# EAGLE design MRCS-Buckeroo (EAGLE 7.7.0)
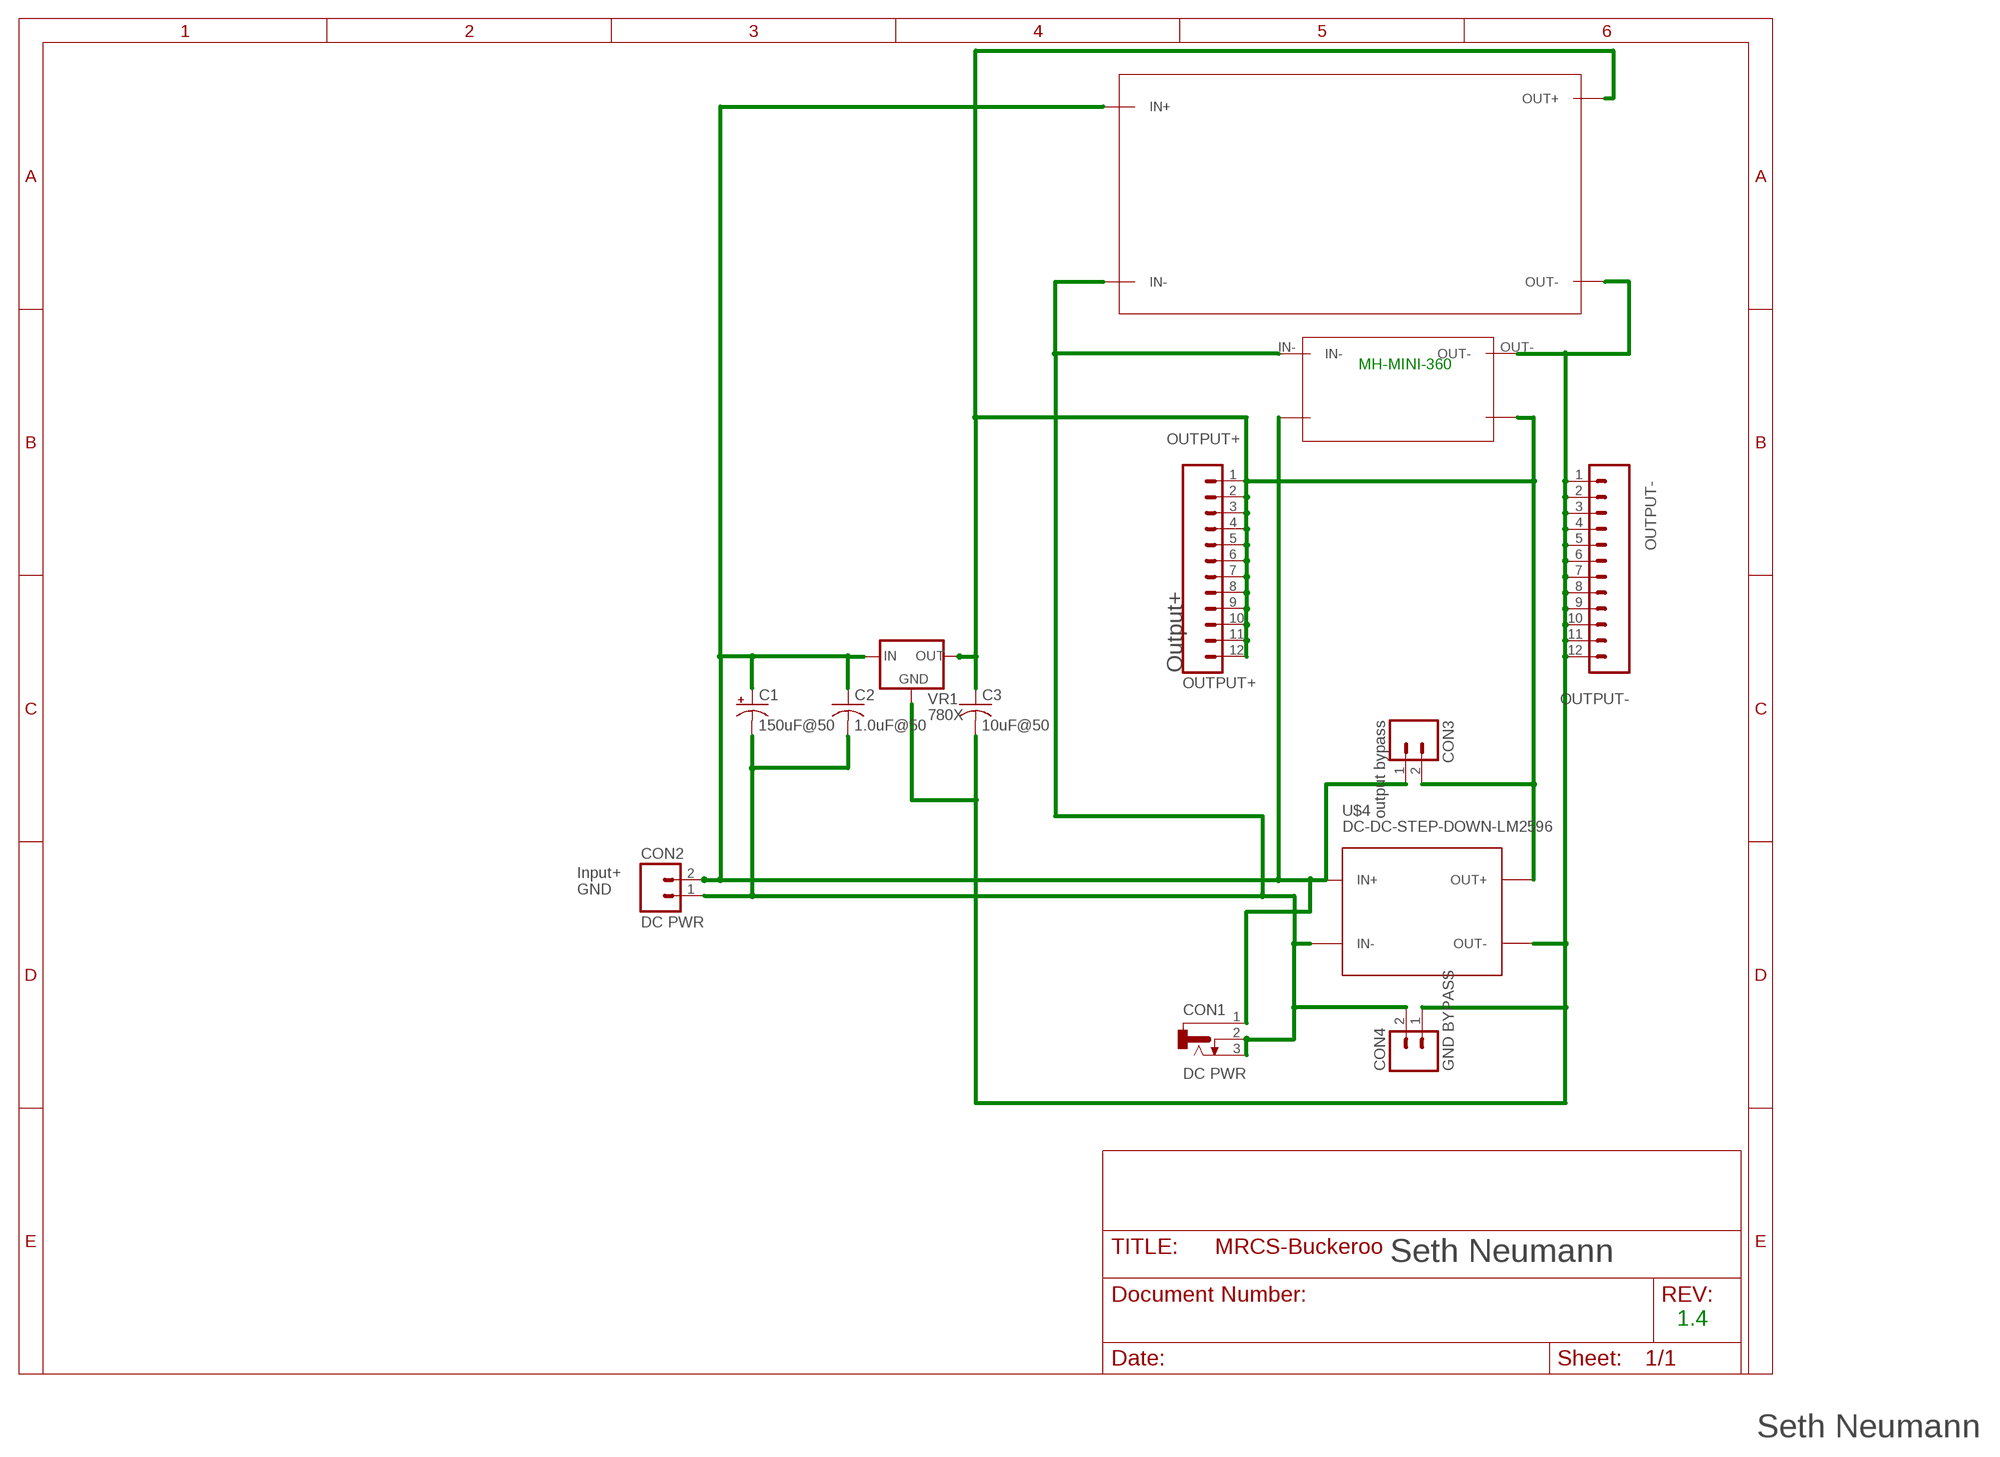
[diagram p0: schematic, sheet 1]

## Parts
C1  150uF@50  CAP-POLPTH-5MM  [E5-10.5]
C2  1.0uF@50  CAPPTH2  [C-PTH-0.100]
C3  10uF@50  CAPPTH2  [C-PTH-0.100]
CON1  DC PWR  CONNECTOR-DC-POWER-RA  [DCJ0202]
CON2  DC PWR  CONNECTOR-M023.5MM-LOCK  [SCREWTERMINAL-3.5MM-2_LOCK]
CON3  output bypass  CONNECTOR-M02MOLEX-1X02-LOCK  [MOLEX-1X2_LOCK]
CON4  GND BYPASS  CONNECTOR-M02MOLEX-1X02-LOCK  [MOLEX-1X2_LOCK]
MH-MINI-360  MH-MINI-360  [MH-MINI-360]
OUTPUT+  OUTPUT+  CONNECTOR-M12LOCK  [1X12_LOCK]
OUTPUT-  OUTPUT-  CONNECTOR-M12LOCK  [1X12_LOCK]
U$4  DC-DC-STEP-DOWN-LM2596  [DC-DC-STEP-DOWN-LM2596]
U$5  XL6009BOARD  [XL6009_BOARD]
VR1  780X  VREG-PTH-RA-  [TO-220-RA]

## Nets
GND: C1.- C2.2 CON1.2 CON1.3 CON2.1(A) CON4.2(B) MH-MINI-360.IN- U$4.IN- U$5.IN-
INPUT+: C1.+ C2.1 CON1.1 CON2.2(B) CON3.1(A) MH-MINI-360.INN+ U$4.IN+ U$5.IN+ VR1.IN
OUTPUT+ [Power]: C3.1 CON3.2(B) MH-MINI-360.OUTT+ OUTPUT+.1 OUTPUT+.2 OUTPUT+.3 OUTPUT+.4 OUTPUT+.5 OUTPUT+.6 OUTPUT+.7 OUTPUT+.8 OUTPUT+.9 OUTPUT+.10 OUTPUT+.11 OUTPUT+.12 U$4.OUT+ U$5.OUT+ VR1.OUT
OUTPUT- [Power]: C3.2 CON4.1(A) MH-MINI-360.OUT- OUTPUT-.1 OUTPUT-.2 OUTPUT-.3 OUTPUT-.4 OUTPUT-.5 OUTPUT-.6 OUTPUT-.7 OUTPUT-.8 OUTPUT-.9 OUTPUT-.10 OUTPUT-.11 OUTPUT-.12 U$4.OUT- U$5.OUT- VR1.GND

## Notes on the sheet
- MH-MINI-360
- Output+
- Input+
  GND
- Seth Neumann
- 1.4
- Seth Neumann

## Library data of the parts
C1 = SPCoast:CAP-POL*
C2 C3 = SPCoast:CAP*
CON1 = SPCoast:CONNECTOR-DC-POWER: DC POWER JACK
CON2-CON4 = SPCoast:CONNECTOR-M02: PHOENIX CONNECTOR
MH-MINI-360 = MRCS:MH-MINI-360: MH-MINI-360
OUTPUT+ OUTPUT- = SPCoast:CONNECTOR-M12: Header 12 Standard 12-pin 0.1" header. Use with straight break away headers (SKU : PRT-00116), right angle break away headers (PRT-00553), swiss pins (PRT-00743), machine pins (PRT-00117), and female headers (PRT-00115).
U$4 = diy-modules:DC-DC-STEP-DOWN-LM2596: DC/DC Step-Down Regulator based on LM2596-ADJ chip LM2596 datasheet available here: http://www.ti.com/lit/ds/symlink/lm2596.pdf Click here to find device on ebay.com <http://www.ebay.com/sch/lm2596+power+regulator>
U$5 = MRCS:XL6009BOARD
VR1 = SPCoast:VREG-?-*: Voltage Regulator Standard linear regulator. 7805 uses IGO pinout LM1117 uses GOI pinout

## Net classes
0 default: width 0.305 mm, drill 0.127 mm, clearance 0.254 mm
1 Power: width 0.61 mm, drill 0.127 mm, clearance 0.254 mm
2 Phone: width 0.406 mm, drill 0.127 mm, clearance 0.381 mm
3 Nasty Loads: width 0.61 mm, drill 0.127 mm, clearance 0.61 mm

## Board
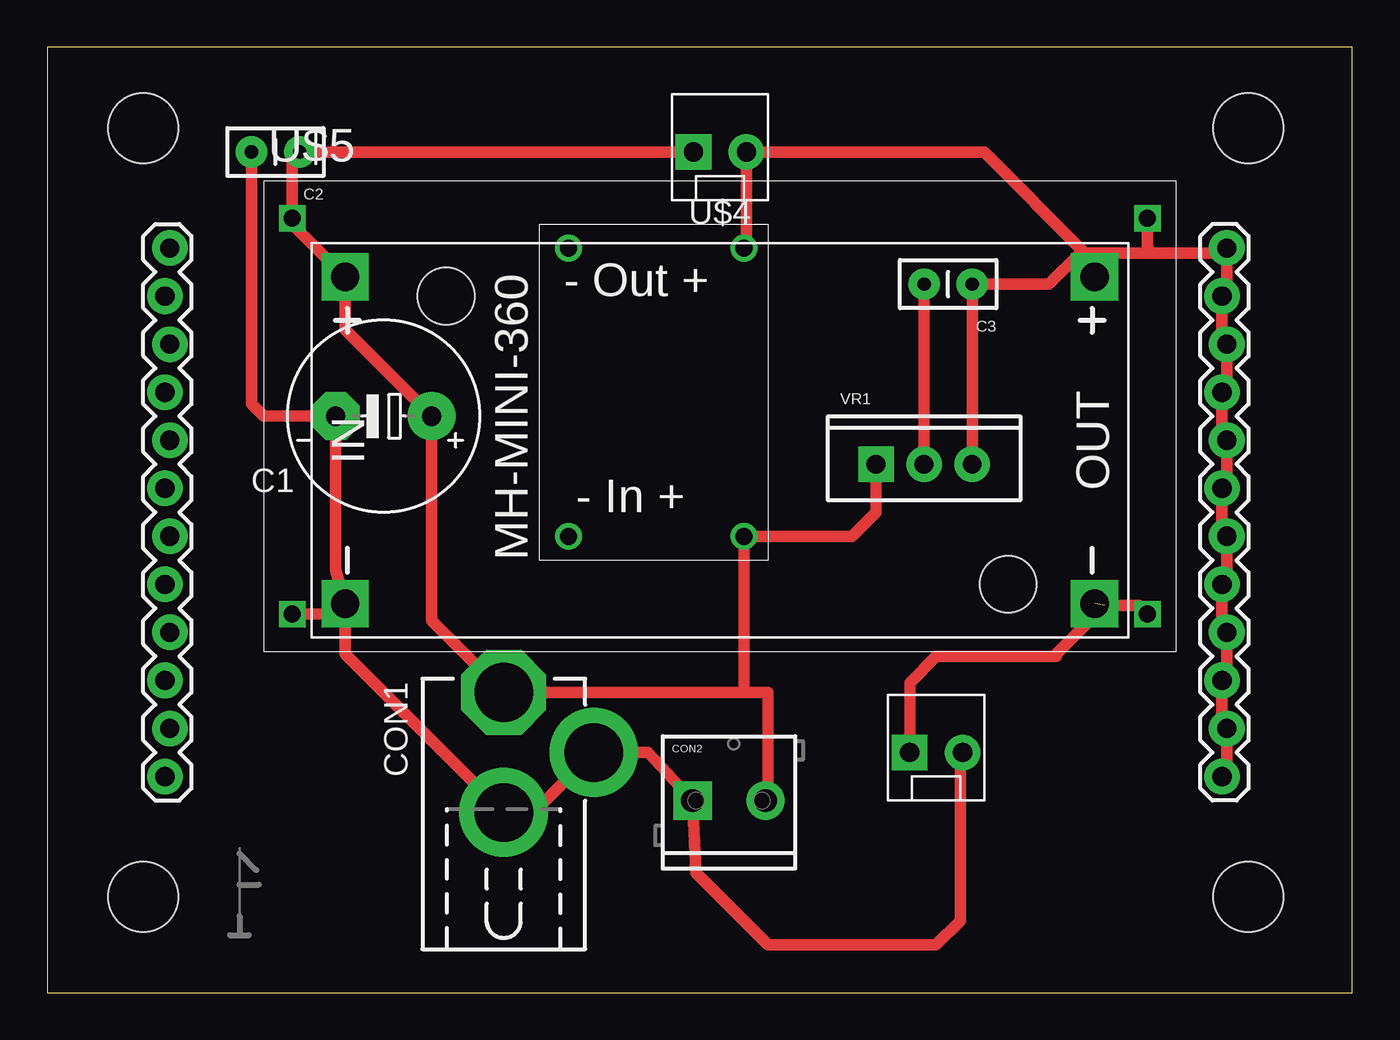
[diagram p1: board, top side]
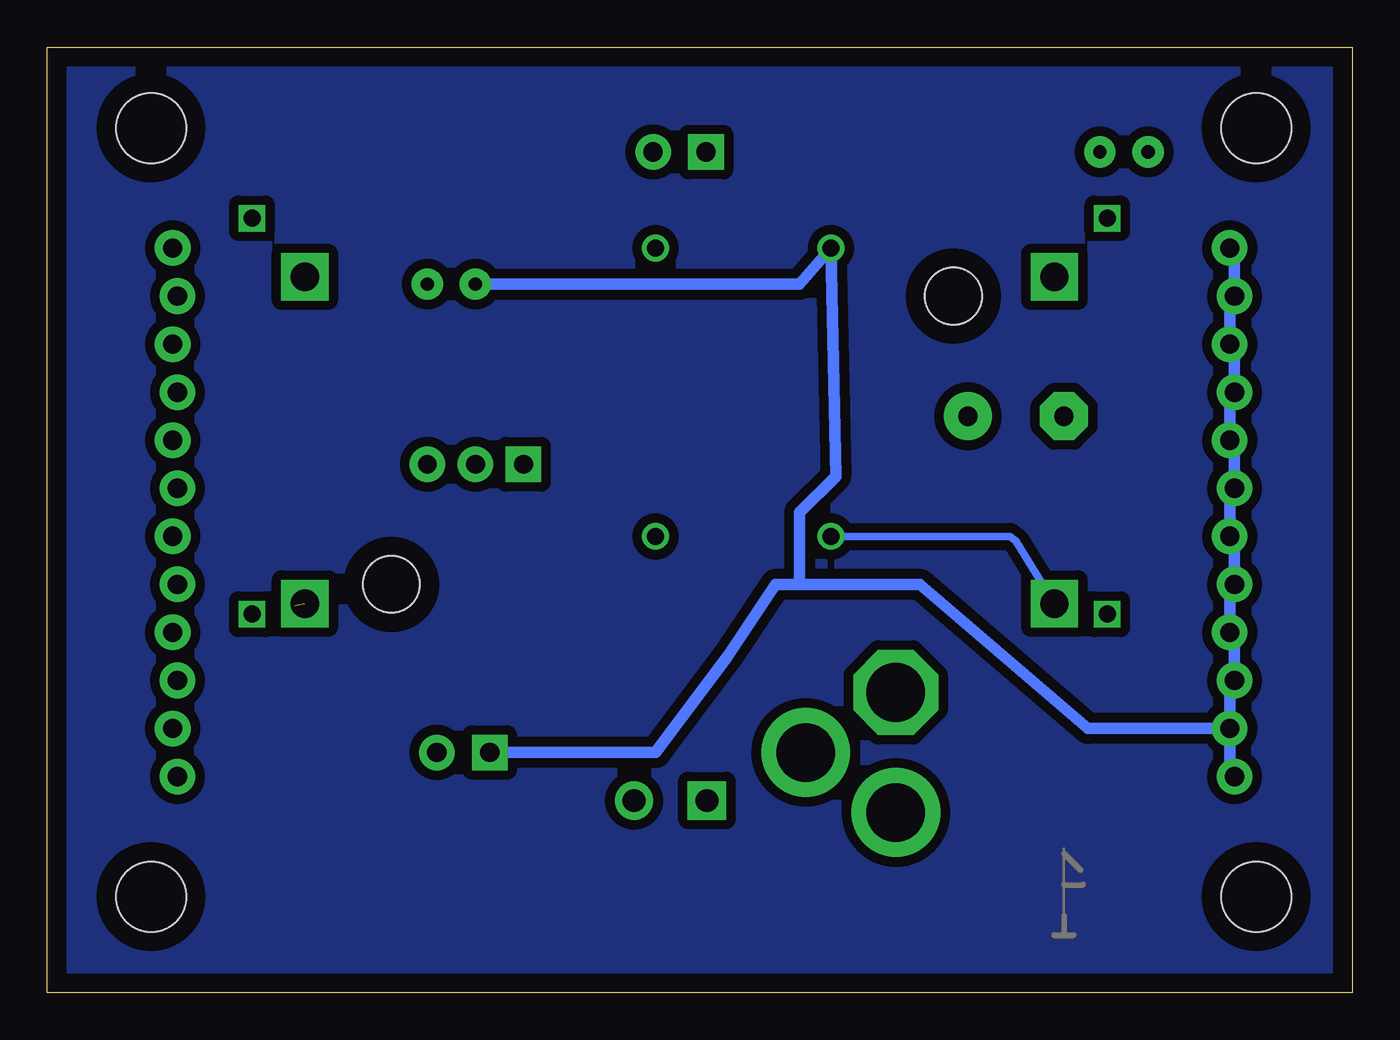
[diagram p2: board, bottom side, seen from below]

Size 68.99 x 49.99 mm. Coordinates in mm from the lower left corner, seen from the top.
Outline: 0,0 68.99,0 68.99,49.99 0,49.99 0,0
Copper layers (1*16): Top 0.035mm / dielectric 1.5mm / Bottom 0.035mm
Design rules "default": minimum track width 10mil, minimum drill 0.6mm, track to track 8mil, track to pad 8mil, pad to pad 8mil, via to via 8mil, smd to smd 8mil, copper to edge 40mil, drill to drill 8mil, minimum pad ring 10mil, minimum via ring 8mil, stop-mask expansion 4mil, vias tented up to drill 0mil, thermal gap 10mil
Holes 3.7 mm at 5.08,5.08 5.08,45.72 63.5,45.72 63.5,5.08

### Footprints (pad centres in the part's own frame; a part is rotated, then mirrored left to right if it is on the bottom)
E5-10.5 = drill 1.016 pad 2.54: + -2.54,0 | drill 1.016 pad 2.54 octagon: - 2.54,0
C-PTH-0.100 = drill 0.7 pad 1.651: 1 -1.27,0; 2 1.27,0
DCJ0202 = drill 3.1 pad 4.5 octagon: 1 0,3.175 | drill 3.1 pad 4.7: 2 4.763,0; 3 0,-3.175
SCREWTERMINAL-3.5MM-2_LOCK = drill 1.2 pad 2.032 square: 1 -0.178,0 | drill 1.2 pad 2.032: 2 3.678,0
MOLEX-1X2_LOCK = drill 1.016 pad 1.88 square: 1 -0.127,0 | drill 1.016 pad 1.88: 2 2.667,0
MH-MINI-360 = drill 0.9: IN- -7.62,4.826; INN+ -7.62,-4.445; OUT- 7.62,4.826; OUTT+ 7.62,-4.445
1X12_LOCK = drill 1.016 pad 1.88: 1 0,0.127; 2 2.54,-0.127; 3 5.08,0.127; 4 7.62,-0.127; 5 10.16,0.127; 6 12.7,-0.127; 7 15.24,0.127; 8 17.78,-0.127; 9 20.32,0.127; 10 22.86,-0.127; 11 25.4,0.127; 12 27.94,-0.127
DC-DC-STEP-DOWN-LM2596 = drill 1.5 pad 2.5 square: IN+ -19.812,8.636; IN- -19.812,-8.636; OUT+ 19.812,8.636; OUT- 19.812,-8.636 | hole 3: -14.478,7.62; 15.24,-7.62
XL6009_BOARD = drill 0.9 square: IN+ -22.606,10.465; IN- -22.606,-10.465; OUT+ 22.606,10.465; OUT- 22.606,-10.465
TO-220-RA = drill 1 pad 1.88: GND 0,0; OUT 2.54,0 | drill 1 pad 1.88 square: IN -2.54,0

### Placement (x,y rotation side)
C1  17.78,30.48 180 top
C2  12.06,44.45 180 top
C3  47.62,37.47 180 top
CON1  24.13,12.7 0 top
CON2  34.29,10.16 0 top
CON3  34.29,44.45 0 top
CON4  45.72,12.7 0 top
MH-MINI-360  32.38,31.75 90 top
OUTPUT+  62.23,39.37 270 top
OUTPUT-  6.35,11.43 90 top
U$1  [CA-PROP65WARNING]  40.64,35.56 0 top
U$2  [MRCSLOGOTOP]  8.89,2.54 0 top
U$3  [MRCSLOGOBTM]  8.89,2.54 0 top
U$4  35.56,29.21 0 top
U$5  35.56,30.48 0 top
VR1  46.35,27.94 0 top

### Tracks (layer width: path | path; a pad name or v marks a point on that pad's centre or on a via)
GND
  Top 0.61: 15.75,20.32 U$4.IN- 15.24,22.35 C1.- 11.43,30.48 10.79,31.11 C2.2 | 15.75,20.32 15.75,17.91 CON1.3 25.72,9.53 CON1.2 31.75,12.7 CON2.1 34.29,6.35 38.1,2.54 46.99,2.54 48.26,3.81 48.26,12.57 CON4.2 | U$5.IN- 15.44,20.02 15.75,20.32
  Bottom 0.406: MH-MINI-360.IN- 18.1,24.13 17.78,23.88 U$4.IN-
INPUT+
  Top 0.61: CON3.1 C2.1 12.95,44.07 U$5.IN+ 12.95,40.64 U$4.IN+ 15.75,35.05 C1.+ 20.32,19.68 CON1.1 | VR1.IN 43.81,25.4 42.55,24.13 MH-MINI-360.INN+ 36.83,15.88 | CON1.1 24.77,15.24 | CON1.1 36.83,15.88 | 36.83,15.88 38.1,15.88 38.1,10.29 CON2.2
OUTOUT-
  pour Bottom (isolate 0.508): 0,0 68.58,0 68.58,49.53 0,49.53
OUTPUT+
  Top 0.61: 54.61,39.12 54.86,39.12 | 54.86,39.12 49.53,44.45 CON3.2 | CON3.2 36.83,44.45 | OUTPUT+.12 62.36,11.68 OUTPUT+.11 62.1,14.22 OUTPUT+.10 62.36,16.76 OUTPUT+.9 62.1,19.3 OUTPUT+.8 62.36,21.84 OUTPUT+.7 62.1,24.38 OUTPUT+.6 62.36,26.92 OUTPUT+.5 62.1,29.46 OUTPUT+.4 62.36,32 OUTPUT+.3 62.1,34.54 OUTPUT+.2 62.36,37.08 OUTPUT+.1 62.1,39.12 58.42,39.12 | U$4.OUT+ 54.61,39.12 | 54.86,39.12 58.42,39.12 | CON3.2 36.96,39.5 MH-MINI-360.OUTT+ | VR1.OUT C3.1 52.96,37.47 54.61,39.12 | U$5.OUT+ 58.17,39.37 58.42,39.12
OUTPUT-  (1 unrouted)
  Top 0.61: CON4.1 45.59,16.38 46.99,17.78 53.34,17.78 53.34,17.92 55.91,20.48 57.7,20.48 U$5.OUT- 58.17,20.07 | VR1.GND C3.2
  Bottom 0.61: OUTPUT-.2 13.97,13.97 22.86,21.59 29.21,21.59 | 29.21,21.59 30.48,21.59 33.02,17.78 36.83,12.7 CON4.1 | 29.21,21.59 29.21,25.4 27.3,27.3 MH-MINI-360.OUT- 29.21,37.47 C3.2 | OUTPUT-.2 6.48,11.68 OUTPUT-.1 | OUTPUT-.2 6.48,16.26 OUTPUT-.3 6.22,18.8 OUTPUT-.4 6.48,21.34 OUTPUT-.5 6.22,23.88 OUTPUT-.6 6.48,26.42 OUTPUT-.7 6.22,28.96 OUTPUT-.8 6.48,31.5 OUTPUT-.9 6.22,34.04 OUTPUT-.10 6.48,36.58 OUTPUT-.11 6.22,39.12 OUTPUT-.12

### Text on the board
tPlace: - Out + | - In +
tDocu: + V Jumper | Output - | Output + | - V / (GND) / JUMP | "Buckeroo V1.4" / Seth Neumann / 20230102 | GND | IN - +